# Altium schematic sheet MCP4725.V03.R00.SchDoc: DAC MCP4725
size A4; SheetNumber: 11; SheetTotal: 18
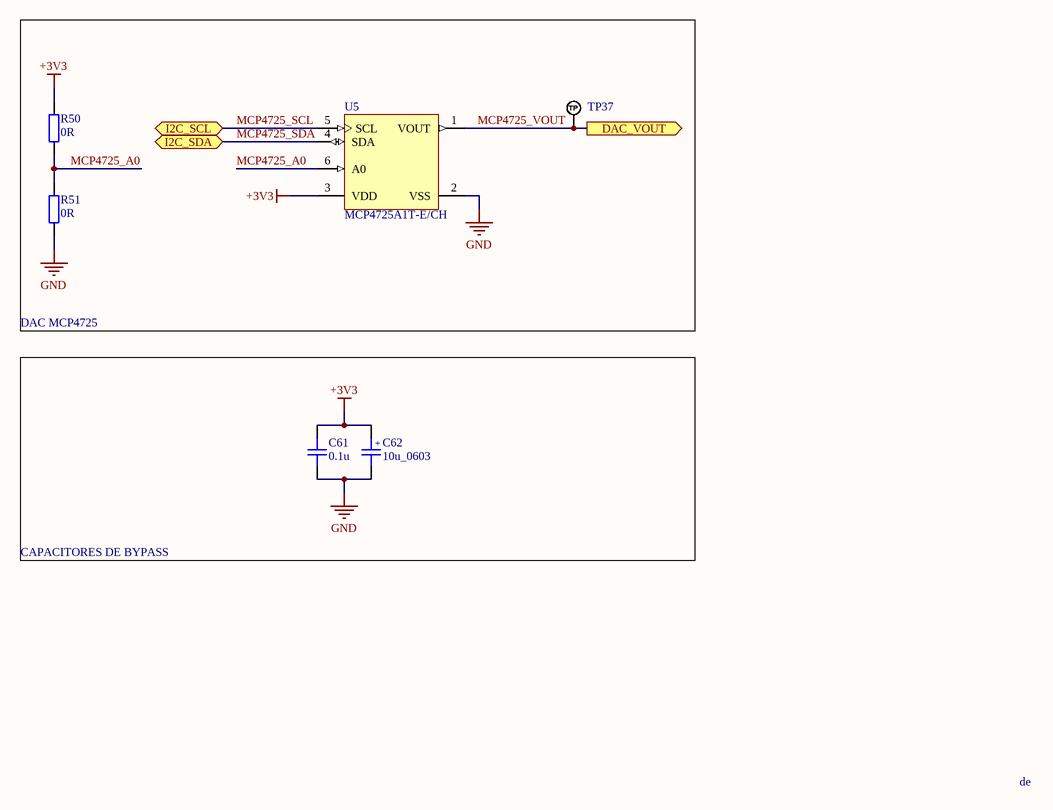
[diagram p0: MCP4725.V03.R00.SchDoc]

## Parts
C61  0.1u  [CAP_0805]
C62  10u_0603  [CAP_TANT_0603]
R50  0R  [RES_0805]
R51  0R  [RES_0805]
TP37  TP_NOBOM  [PAD_RND_1MM]  (value not drawn)  (no BOM)
U5  MCP4725A1T-E/CH  [SOT-23-CH6_N]

## Blocks framed on the sheet
DAC MCP4725: R50 R51 TP37 U5
CAPACITORES DE BYPASS: C61 C62

## Ports
DAC_VOUT (out), I2C_SCL (bidir), I2C_SDA (bidir)

## Nets
+3V3: C61.1 C62.A R50.2 U5.3(VDD)
GND: C61.2 C62.K R51.1 U5.2(VSS)
MCP4725_A0: R50.1 R51.2 U5.6(A0)
MCP4725_SCL: U5.5(SCL) ; port I2C_SCL
MCP4725_SDA: U5.4(SDA) ; port I2C_SDA
MCP4725_VOUT: TP37.1(TP) U5.1(VOUT) ; port DAC_VOUT

## Notes on the sheet
- de
- (in symbol CAP_TANT_0603) +

## Library data of the parts
C61 = CAP_0805: Capacitor SMD 0805; Manufacturer: *; Manufacturer Part Number: *; Distributor Link: *; LCSC: *; Rating: *; Dielectric: *
C62 = CAP_TANT_0603: Capacitor SMD Tantalum 0603; Manufacturer: *; Manufacturer Part Number: *; Distributor Link: *; LCSC: *
R50 R51 = RES_0805: Resistor SMD 0805; Manufacturer: *; Manufacturer Part Number: *; Distributor Link: *; LCSC: *
TP37 = TEST_POINT_RND_1MM: Test Point Round 1mm (NO BOM)
U5 = CMP-0188-00759-2: 12-Bit Digital-to-Analog Converter with EEPROM Memory in SOT-23-6, 6-Pin SOT-23, Extended Temperature, Tape and Reel; RevisionNote: URLs added.; ComponentLink2Description: Datasheet; PackageDescription: 6-Lead Plastic Small Outline Transistor (CH) [SOT-23]; DatasheetVersion: revD, Jun-2009; ComponentLink1Description: Manufacturer URL; Code_IPC: SOT26A-6; ComponentLink3URL: http://www.microchip.com/stellent/groups/techpub_sg/documents/packagingspec/en012702.pdf; ComponentLink1URL: http://www.microchip.com/; ComponentLink3Description: Package Specification; PackageVersion: revBB, Aug-2009; ComponentLink2URL: http://ww1.microchip.com/downloads/en/DeviceDoc/22039d.pdf; PackageReference: SOT-23-CH6